# EAGLE design board (EAGLE 7.7.0)
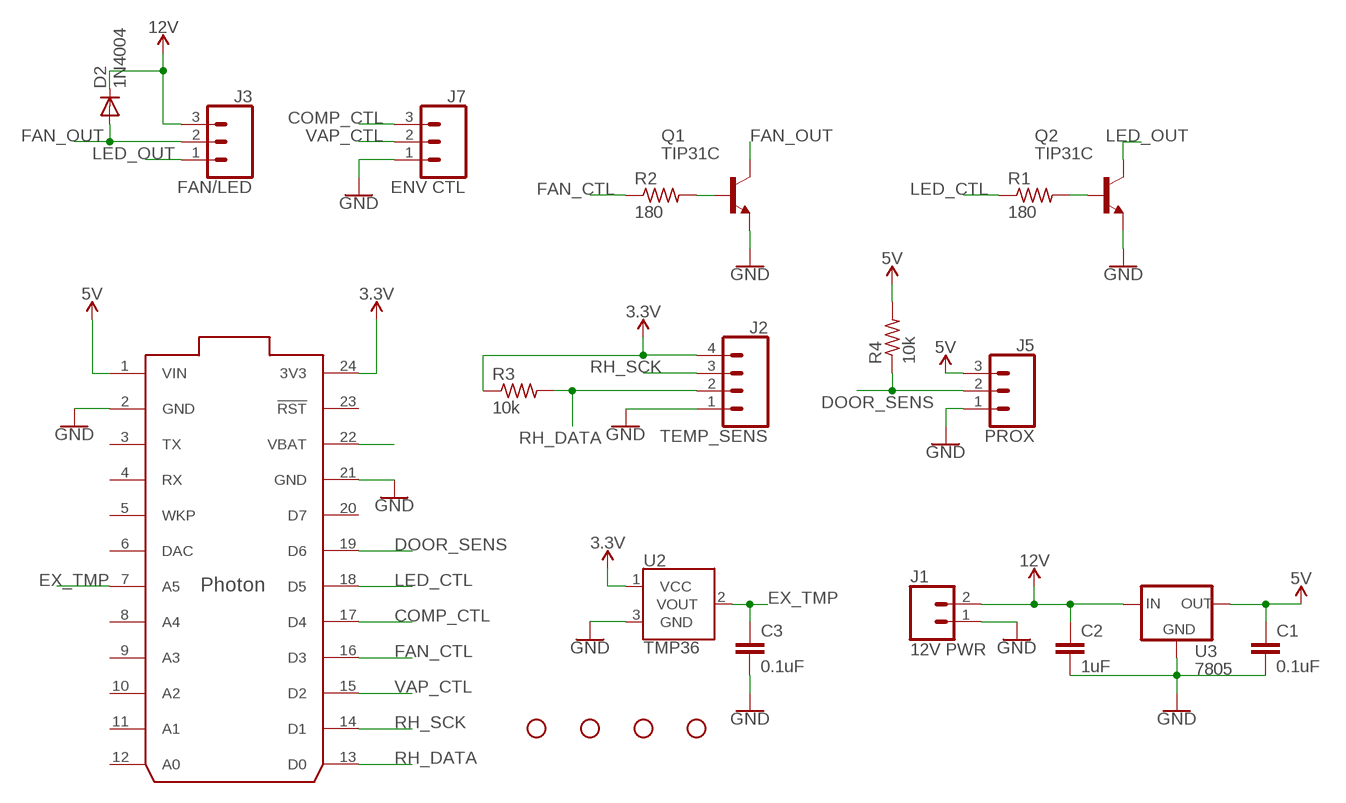
[diagram p0: schematic, sheet 1]

## Parts
C1  0.1uF  0.1UF-KIT-EZ-50V-20%  [CAP-PTH-SMALL-KIT]
C2  1uF  0.1UF-KIT-EZ-50V-20%  [CAP-PTH-SMALL-KIT]
C3  0.1uF  0.1UF-KIT-EZ-50V-20%  [CAP-PTH-SMALL-KIT]
D2  1N4004  [DO41-10]
H1  STAND-OFF  [STAND-OFF]
H2  STAND-OFF  [STAND-OFF]
H3  STAND-OFF  [STAND-OFF]
H4  STAND-OFF  [STAND-OFF]
J1  12V PWR  CONN_023.5MM  [SCREWTERMINAL-3.5MM-2]
J2  TEMP_SENS  CONN_04SCREW_LOCK  [SCREWTERMINAL-3.5MM-4_LOCK]
J3  FAN/LED  CONN_03-SCREW-5MM  [SCREWTERMINAL-5MM-3]
J5  PROX  CONN_03-SCREW-5MM  [SCREWTERMINAL-5MM-3]
J7  ENV CTL  CONN_03-SCREW-5MM  [SCREWTERMINAL-5MM-3]
Q1  TIP31C  [TO220]
Q2  TIP31C  [TO220]
R1  180  R-US_0207/10  [0207/10]
R2  180  R-US_0207/10  [0207/10]
R3  10k  R-US_0207/10  [0207/10]
R4  10k  R-US_0207/10  [0207/10]
U2  TMP36  TMP36GT9  [TO-92]
U3  7805  V_REG_78XX-TO-220  [TO-220-ALT]
U$1  PHOTON_SMD  [PHOTON_SMD]

## Nets
3.3V: J2.4 R3.1 U2.1(VCC) U$1.24(3V3)
5V [5VPWR]: C1.1 J5.3 R4.2 U3.OUT U$1.1(VIN)
12V [12VPWR]: C2.1 D2.C J1.2 J3.3 U3.IN
COMP_CTL: J7.3 U$1.17(D4)
DOOR_SENS: J5.2 R4.1 U$1.19(D6)
EX_TMP: C3.1 U2.2(VOUT) U$1.7(A5)
FAN_CTL: R2.1 U$1.16(D3)
FAN_OUT [12VPWR]: D2.A J3.2 Q1.2(C)
GND [Ground]: C1.2 C2.2 C3.2 J1.1 J2.1 J5.1 J7.1 Q1.3(E) Q2.3(E) U2.3(GND) U3.GND U$1.2(GND) U$1.21(GND)
LED_CTL: R1.1 U$1.18(D5)
LED_OUT [12VPWR]: J3.1 Q2.2(C)
N$1: U$1.22(VBAT)
N$3: Q2.1(B) R1.2
N$8: Q1.1(B) R2.2
RH_DATA: J2.2 R3.2 U$1.13(D0)
RH_SCK: J2.3 U$1.14(D1)
VAP_CTL: J7.2 U$1.15(D2)
Unconnected: U$1.3(TX) U$1.4(RX) U$1.5(WKP) U$1.6(DAC) U$1.8(A4) U$1.9(A3) U$1.10(A2) U$1.11(A1) U$1.12(A0) U$1.20(D7) U$1.23(!RST) U$1.25(EN) U$1.26(!SETUP) U$1.27(RGB_RED) U$1.28(RGB_GREEN) U$1.29(RGB_BLUE) U$1.30(USB_D-) U$1.31(USB_D+)

## Library data of the parts
C1 C3 = SparkFun-Capacitors:0.1UF: 0.1µF ceramic capacitors A capacitor is a passive two-terminal electrical component used to store electrical energy temporarily in an electric field.; PROD_ID: CAP-08370
C2 = SparkFun-Capacitors:0.1UF: 0.1µF ceramic capacitors A capacitor is a passive two-terminal electrical component used to store electrical energy temporarily in an electric field.; PROD_ID: CAP-08370; VALUE: 0.1uF
D2 = diode:1N4004: DIODE general purpose rectifier, 1 A
H1-H4 = SparkFun-Hardware:STAND-OFF: Stand Off Drill holes for mechanically mounting via screws, standoffs, etc. Note: Use the keepout ring to avoid running the screw head into surrounding components. Variant Overviews STAND-OFF - Mechanical footprint for a #4 phillips button head screw. STAND-OFF-TIGHT - Mechanical footprint for a #4 phillips button head screw, Example SparkFun Products Screw - Phillips Head (1/4", 4-40, 10 pack) <https://www.sparkfun.com/products/10453> (PRT-10453) Screw - Phillips Head (1/2", 4-40, 10 pack) <https://www.sparkfun.com/products/10452> (PRT-10452) Screw - Phillips Head (3/4", 4-40, 10 pack) <https://www.sparkfun.com/products/10451> (PRT-10451) Screw - Phillips Head (1", 4-40, 10 pack) <https://www.sparkfun.com/products/10450> (PRT-10450)
J1 = SparkFun-Connectors:CONN_02: Multi connection point. Often used as Generic Header-pin footprint for 0.1 inch spaced/style header connections On any of the 0.1 inch spaced packages, you can populate with these: Break Away Headers - Straight <https://www.sparkfun.com/products/116> (PRT-00116) Break Away Male Headers - Right Angle <https://www.sparkfun.com/products/553> (PRT-00553) Female Headers <https://www.sparkfun.com/products/115> (PRT-00115) Break Away Headers - Machine Pin <https://www.sparkfun.com/products/117> (PRT-00117) Break Away Female Headers - Swiss Machine Pin <https://www.sparkfun.com/products/743> (PRT-00743) For SCREWTERMINALS and SPRING TERMINALS visit here: Screw Terimnals on SparkFun.com <https://www.sparkfun.com/search/results?term=Screw+Terminals> (5mm/3.5mm/2.54mm spacing) This device is also useful as a general connection point to wire up your design to another part of your project. Our various solder wires solder well into these plated through hole pads. Hook-Up Wire - Assortment (Stranded, 22 AWG) <https://www.sparkfun.com/products/11375> (PRT-11375) Hook-Up Wire - Assortment (Solid Core, 22 AWG) <https://www.sparkfun.com/products/11367> (PRT-11367) View the entire wire category on our website here <https://www.sparkfun.com/categories/141> Special notes: Molex polarized connector foot print use with: PRT-08233 with associated crimp pins and housings. 2.54_SCREWTERM for use with PRT-10571. 3.5mm Screw Terminal footprints for PRT-08084 5mm Screw Terminal footprints for use with PRT-08432; PROD_ID: CONN-08399
J2 = SparkFun-Connectors:CONN_04: Multi connection point. Often used as Generic Header-pin footprint for 0.1 inch spaced/style header connections On any of the 0.1 inch spaced packages, you can populate with these: Break Away Headers - Straight <https://www.sparkfun.com/products/116> (PRT-00116) Break Away Male Headers - Right Angle <https://www.sparkfun.com/products/553> (PRT-00553) Female Headers <https://www.sparkfun.com/products/115> (PRT-00115) Break Away Headers - Machine Pin <https://www.sparkfun.com/products/117> (PRT-00117) Break Away Female Headers - Swiss Machine Pin <https://www.sparkfun.com/products/743> (PRT-00743) For SCREWTERMINALS and SPRING TERMINALS visit here: Screw Terimnals on SparkFun.com <https://www.sparkfun.com/search/results?term=Screw+Terminals> (5mm/3.5mm/2.54mm spacing) This device is also useful as a general connection point to wire up your design to another part of your project. Our various solder wires solder well into these plated through hole pads. Hook-Up Wire - Assortment (Stranded, 22 AWG) <https://www.sparkfun.com/products/11375> (PRT-11375) Hook-Up Wire - Assortment (Solid Core, 22 AWG) <https://www.sparkfun.com/products/11367> (PRT-11367) View the entire wire category on our website here <https://www.sparkfun.com/categories/141> Special notes: Molex polarized connector foot print use with SKU : PRT-08231 with associated crimp pins and housings. 1MM SMD Version SKU: PRT-10208
J3 J5 J7 = SparkFun-Connectors:CONN_03: Multi connection point. Often used as Generic Header-pin footprint for 0.1 inch spaced/style header connections On any of the 0.1 inch spaced packages, you can populate with these: Break Away Headers - Straight <https://www.sparkfun.com/products/116> (PRT-00116) Break Away Male Headers - Right Angle <https://www.sparkfun.com/products/553> (PRT-00553) Female Headers <https://www.sparkfun.com/products/115> (PRT-00115) Break Away Headers - Machine Pin <https://www.sparkfun.com/products/117> (PRT-00117) Break Away Female Headers - Swiss Machine Pin <https://www.sparkfun.com/products/743> (PRT-00743) Stackable Header - 3 Pin (Female, 0.1") <https://www.sparkfun.com/products/13875> (PRT-13875) For SCREWTERMINALS and SPRING TERMINALS visit here: Screw Terimnals on SparkFun.com <https://www.sparkfun.com/search/results?term=Screw+Terminals> (5mm/3.5mm/2.54mm spacing) This device is also useful as a general connection point to wire up your design to another part of your project. Our various solder wires solder well into these plated through hole pads. Hook-Up Wire - Assortment (Stranded, 22 AWG) <https://www.sparkfun.com/products/11375> (PRT-11375) Hook-Up Wire - Assortment (Solid Core, 22 AWG) <https://www.sparkfun.com/products/11367> (PRT-11367) View the entire wire category on our website here <https://www.sparkfun.com/categories/141> Special notes: Molex polarized connector foot print use with SKU : PRT-08232 with associated crimp pins and housings.; PROD_ID: CONN-10134; SF_SKU: PRT-08433
Q1 Q2 = transistor-npn:TIP31C*: NPN Transistor
R1-R4 = resistor:R-US_: RESISTOR, American symbol
U2 = SparkFun-Sensors:TMP36: TMP36 Precision Analog °C Temperature Sensor The TMP36 is a low voltage, precision centigrade temperature sensor. It provides a voltage output that is linearly proportional to the Celsius temperature. It also doesn’t require any external calibration to provide typical accuracies of ±1°C at +25°C and ±2°C over the −40°C to +125°C temperature range. We like it because it’s so easy to use: Just give the device a ground and 2.7 to 5.5 VDC and read the voltage on the Vout pin. The output voltage can be converted to temperature easily using the scale factor of 10 mV/°C. Datasheet <http://cdn.sparkfun.com/datasheets/Sensors/Temp/TMP35_36_37.pdf> SparkFun Products Temperature Sensor - TMP36 <https://www.sparkfun.com/products/10988> (SEN-10988) SparkFun Danger Shield <https://www.sparkfun.com/products/11649> (DEV-11649); PROD_ID: IC-09880; SF_ID: SEN-10988
U3 = SparkFun-IC-Power:V_REG_78XX: Voltage Regulator Standard 78xx regulator. IGO (Input Ground Output). Spark Fun Electronics SKU : COM-00107; PROD_ID: VREG-08450; SF_ID: COM-00107
U$1 = Particle-Devices:PHOTON_SMD: Particle Photon (without headers) WiFi development board footprint - designed to be surface mounted with 7 extra exposed pads on the bottom of the board which include, 3 RGB LED outputs, /SETUP, EN (3.3V SMPS enable input), USB D+ and USB D-. Product datasheet: here <https://docs.particle.io/datasheets/photon-(wifi)/photon-datasheet/> Design files: here <https://github.com/particle-iot/photon> Github : Particle devices library <https://github.com/particle-iot/hardware-libraries/tree/master/Eagle>

## Net classes
0 default: width 0.457 mm
1 12VPWR: width 0.813 mm
2 5VPWR: width 0.61 mm
3 Ground: width 0.813 mm

## Board
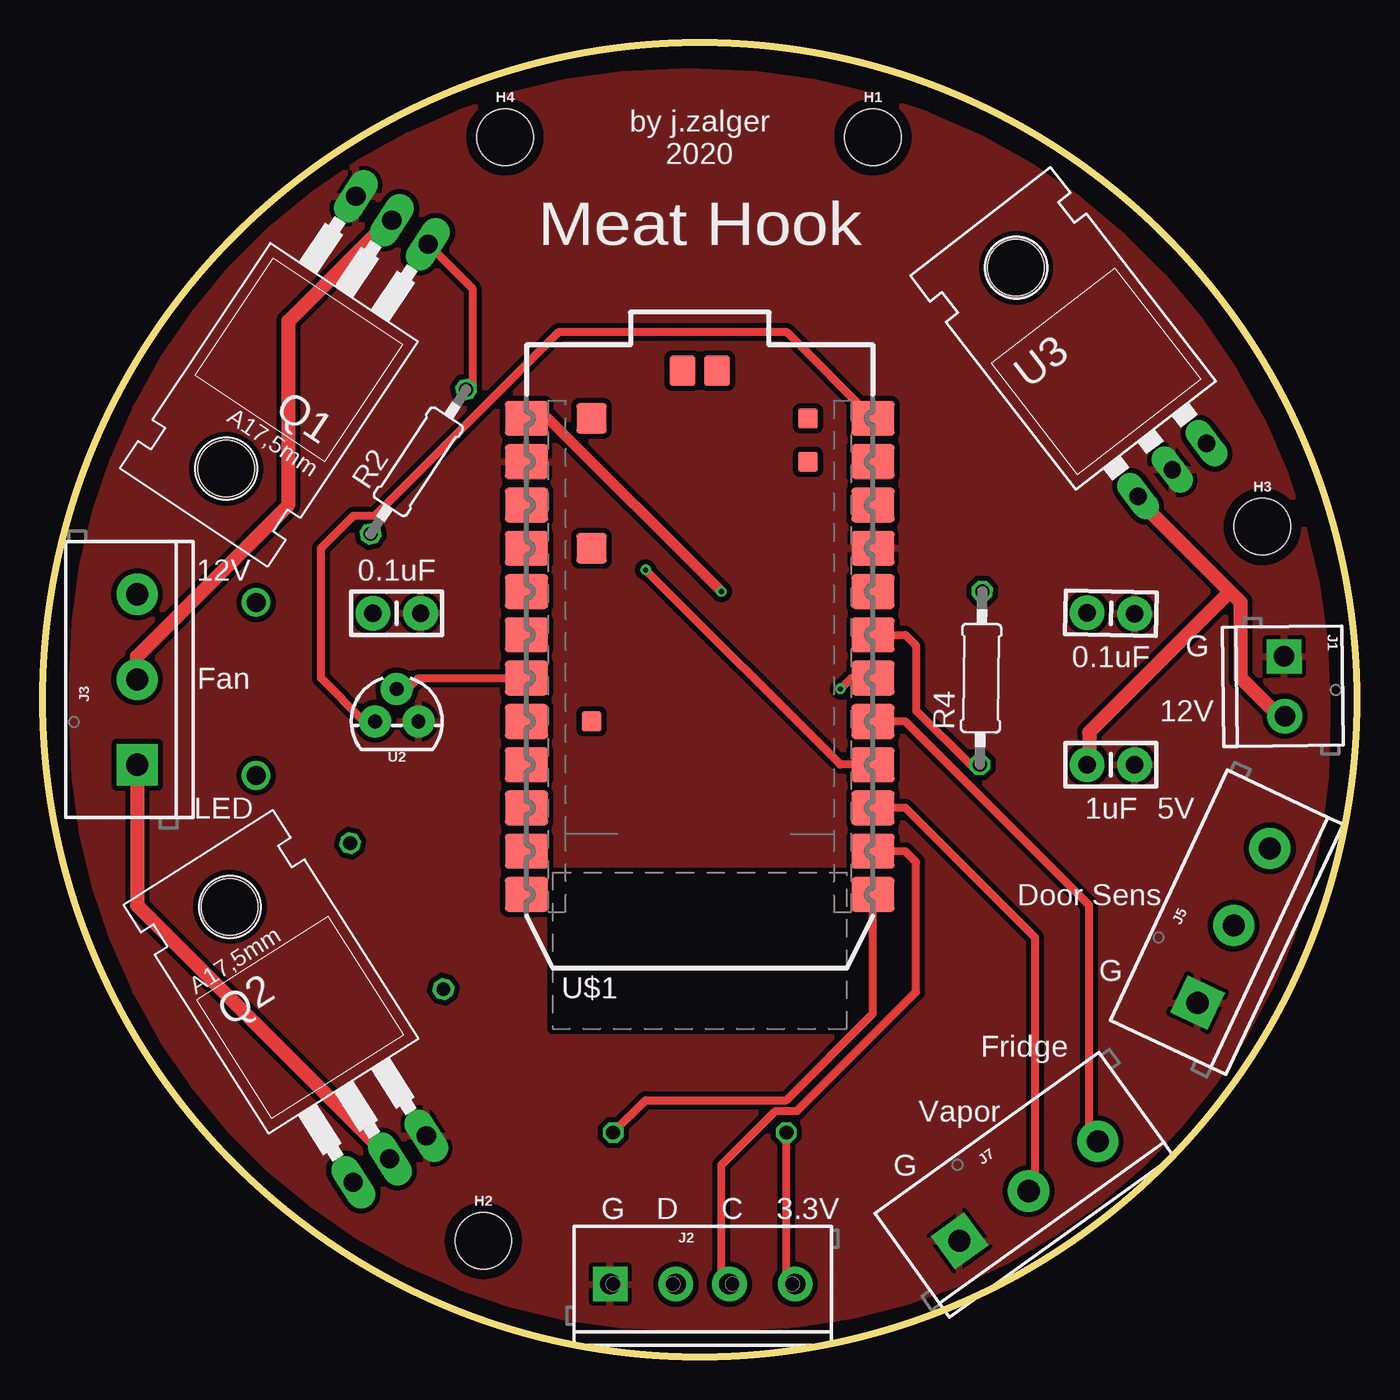
[diagram p1: board, top side]
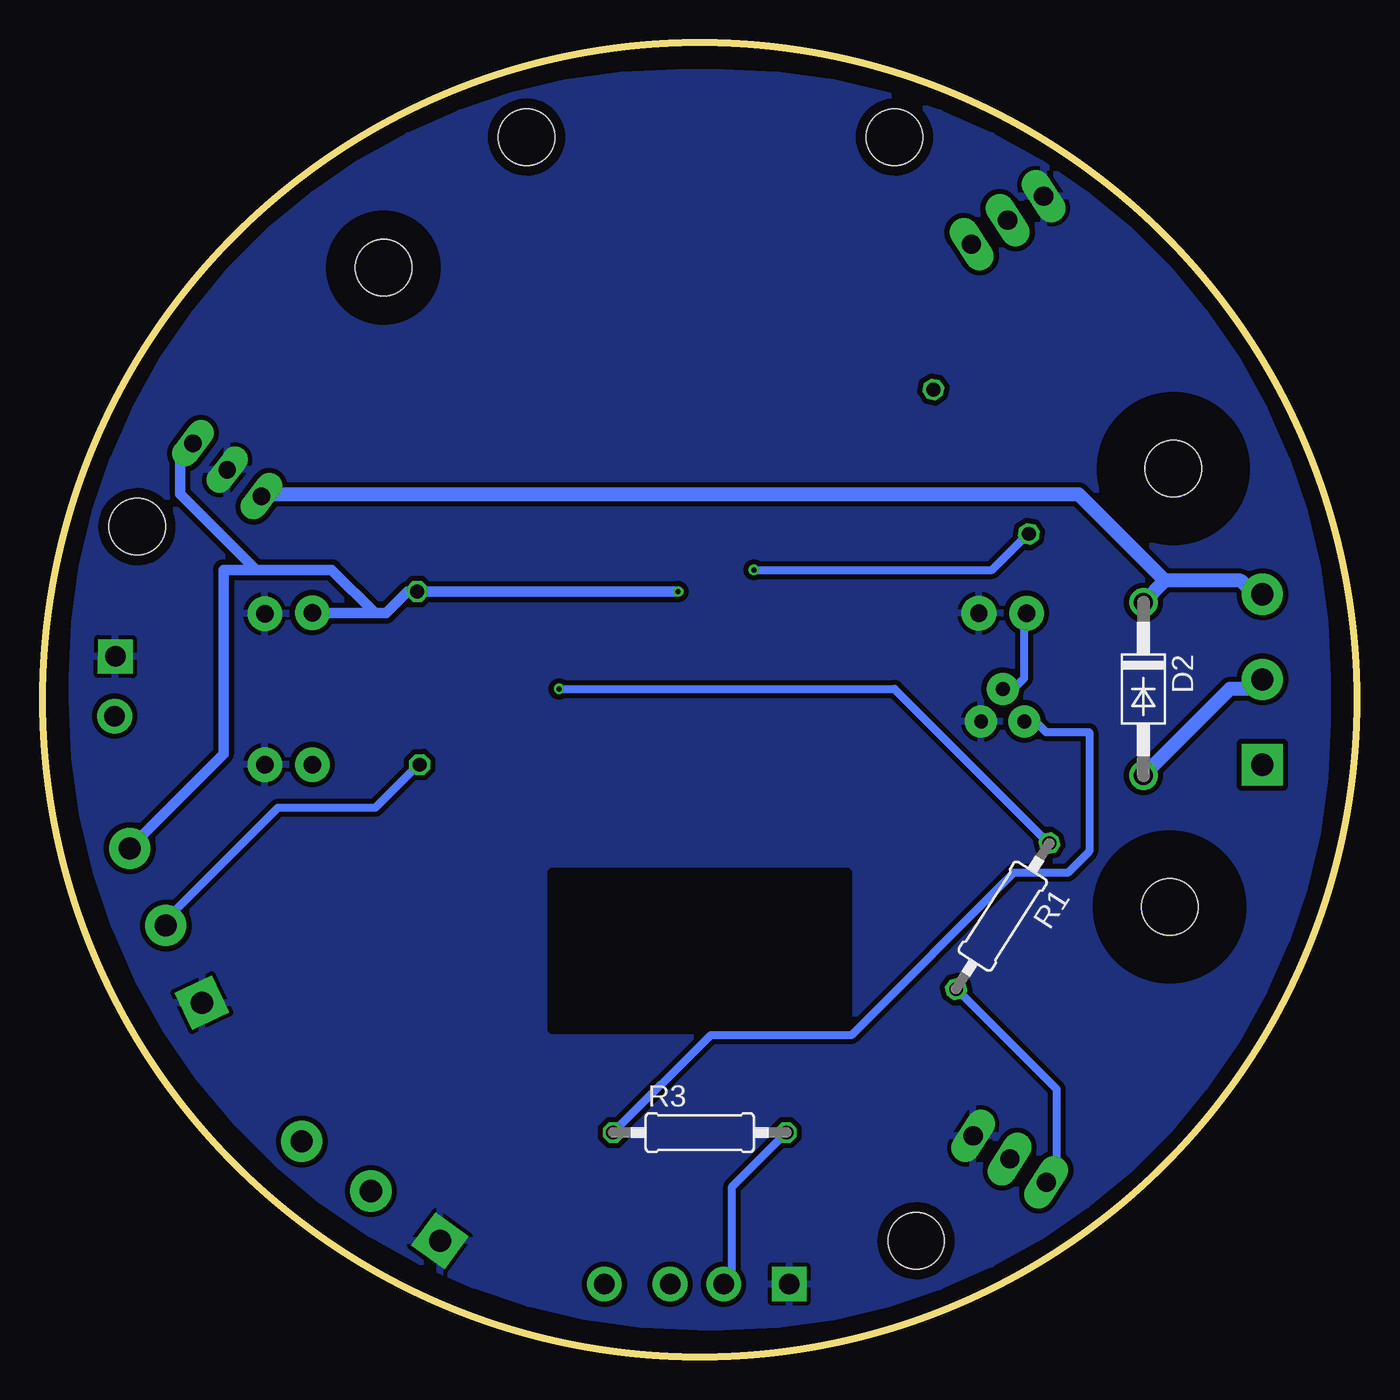
[diagram p2: board, bottom side, seen from below]

Size 77.13 x 77.13 mm. Coordinates in mm from the lower left corner, seen from the top.
Outline: circle at 38.56,38.56 radius 38.56
Copper layers (1*16): Top 0.035mm / dielectric 1.6mm / Bottom 0.035mm
Design rules "Elecrow_2-layer_PCB_eagle_rule": minimum track width 6mil, minimum drill 12mil, track to track 6mil, track to pad 6mil, pad to pad 6mil, via to via 8mil, smd to smd 0mil, copper to edge 20mil, drill to drill 10mil, minimum pad ring 6mil, minimum via ring 6mil, stop-mask expansion 0mil, vias tented up to drill 100mil, thermal gap 10mil

### Footprints (pad centres in the part's own frame; a part is rotated, then mirrored left to right if it is on the bottom)
CAP-PTH-SMALL-KIT = drill 1.016 pad 2.032: 1 -1.397,0; 2 1.397,0
DO41-10 = drill 1.118: A 5.08,0; C -5.08,0
STAND-OFF = hole 3.302: 0,0
SCREWTERMINAL-3.5MM-2 = drill 1.2 pad 2.032 square: 1 0,0 | drill 1.2 pad 2.032: 2 3.5,0
SCREWTERMINAL-3.5MM-4_LOCK = drill 1.2 pad 2.032 square: 1 -0.178,0 | drill 1.2 pad 2.032: 2 3.678,0; 3 6.822,0; 4 10.678,0
SCREWTERMINAL-5MM-3 = drill 1.3 pad 2.413 square: 1 0,0 | drill 1.3 pad 2.413: 2 5,0; 3 10,0
TO220 = drill 1.118 long: 1 -2.54,-6.35; 2 0,-6.35; 3 2.54,-6.35 | hole 3.302: 0,11.176
0207/10 = drill 0.813 octagon: 1 -5.08,0; 2 5.08,0
TO-92 = drill 0.813 pad 1.88: 1 -1.27,0; 2 0,1.905; 3 1.27,0
TO-220-ALT = drill 1.016 long: GND 0,-3.81; IN -2.54,-3.81; OUT 2.54,-3.81 | hole 3.302: 0,11.176
PHOTON_SMD = smd 2.54 x 2.032: 1 0,33.02; 2 0,30.48; 3 0,27.94; 4 0,25.4; 5 0,22.86; 6 0,20.32; 7 0,17.78; 8 0,15.24; 9 0,12.7; 10 0,10.16; 11 0,7.62; 12 0,5.08; 13 20.32,5.08; 14 20.32,7.62; 15 20.32,10.16; 16 20.32,12.7; 17 20.32,15.24; 18 20.32,17.78; 19 20.32,20.32; 20 20.32,22.86; 21 20.32,25.4; 22 20.32,27.94; 23 20.32,30.48; 24 20.32,33.02 | smd 1.778 x 1.778: 25 3.81,33.02; 26 3.81,25.4 | smd 1.143 x 1.143: 27 3.81,15.24; 28 16.51,30.48; 29 16.51,33.02 | smd 1.524 x 1.778: 30 11.176,35.814; 31 9.144,35.814

### Placement (x,y rotation side)
C1  62.69,43.64 358.7 top
C2  62.69,34.75 0 top
C3  20.78,43.64 0 top
D2  12.53,39.2 270 bottom
H1  48.72,71.58 0 top
H2  25.86,6.81 0 top
H3  71.58,48.72 0 top
H4  27.13,71.58 0 top
J1  72.85,41.1 270.7 top
J2  33.48,4.27 0 top
J3  5.54,34.75 90 top
J5  67.77,20.78 64.9 top
J7  53.8,6.81 35.7 top
Q1  16.97,61.42 146.3 top
Q2  16.97,16.97 32.4 top
R1  20.78,25.86 237.4 bottom
R2  22.05,52.53 56.5 top
R3  38.56,13.16 0 bottom
R4  55.07,39.83 89.2 top
U2  20.78,37.29 0 top
U3  63.96,55.07 37.7 top
U$1  28.4,22.05 0 top

### Tracks (layer width: path | path; a pad name or v marks a point on that pad's centre or on a via)
3.3V
  Top 0.457: R3.1 43.64,4.27 J2.4 | U$1.24 43.64,60.15 30.31,60.15 19.51,49.36 18.24,49.36 16.34,47.45 16.34,39.83 18.88,37.29 U2.1
  Bottom 0.457: R3.1 37.93,18.88 29.67,18.88 20.15,28.4 16.97,28.4 15.7,29.67 15.7,36.66 18.24,36.66 18.88,37.29 U2.1
5V  (via drill 0.3)
  Top 0.61: U$1.1 29.67,55.07 v39.83,44.91
  Bottom 0.61: 57.61,43.64 60.79,43.64 C1.1 | 57.61,43.64 56.98,43.64 55.71,44.91 R4.2 55.07,44.91 v39.83,44.91 | 64.6,46.18 69.04,50.63 69.04,52.53 68.41,53.17 U3.OUT | 64.6,46.18 60.15,46.18 57.61,43.64 | 64.6,46.18 66.5,46.18 66.5,35.39 71.58,30.31 J5.3
12V
  Top 0.813: 69.68,44.91 70.31,44.28 70.31,39.83 72.85,37.29 J1.2 | 69.68,44.91 64.6,49.99 U3.IN | 69.68,44.91 61.42,36.66 61.42,34.75 C2.1
  Bottom 0.813: 11.26,45.55 D2.C | 11.26,45.55 6.81,45.55 6.18,44.91 5.54,44.91 J3.3 | 11.26,45.55 16.34,50.63 63.96,50.63 U3.IN
COMP_CTL
  Top 0.457: U$1.17 50.63,37.29 61.42,26.5 61.42,13.16 J7.3
DOOR_SENS
  Top 0.457: U$1.19 50.63,42.37 51.26,41.74 51.26,37.93 54.44,34.75 R4.1
  Bottom 0.457: J5.2 69.68,25.86 63.33,32.21 57.61,32.21 55.07,34.75 R4.1
EX_TMP
  Top 0.457: U$1.7 22.05,39.83 21.42,39.2 U2.2
  Bottom 0.457: U2.2 20.15,39.2 19.51,39.83 19.51,43.64 C3.1
FAN_CTL  (via drill 0.3)
  Top 0.457: v35.39,46.18 46.82,34.75 U$1.16
  Bottom 0.457: v35.39,46.18 21.42,46.18 19.51,48.09 R2.1
FAN_OUT
  Top 0.813: J3.2 5.54,41.1 14.43,49.99 14.43,60.79 20.15,66.5 Q1.2
  Bottom 0.813: D2.A 7.45,39.2 5.54,39.2 J3.2
GND
  pour Bottom (isolate 0.305): 38.56,1.73 arc90 75.39,38.56 75.39,39.83 arc90 39.83,75.39 37.29,75.39 arc90 1.73,39.83 1.73,37.29 arc90 37.29,1.73
  pour Top (isolate 0.305): 41.1,1.73 arc90 75.39,37.29 75.39,38.56 arc90 38.56,75.39 37.29,75.39 arc90 1.73,39.83 1.73,37.29 arc90 37.29,1.73
LED_CTL  (via drill 0.3)
  Top 0.457: v46.82,39.2 47.45,39.83 U$1.18
  Bottom 0.457: v46.82,39.2 27.13,39.2 18.24,30.31 R1.1
LED_OUT
  Top 0.813: J3.1 5.54,26.5 20.15,11.89 Q2.2
N$3
  Bottom 0.457: R1.2 23.32,21.42 17.61,15.7 17.61,10.62 Q2.1
N$8
  Top 0.457: R2.2 25.23,56.98 25.23,62.69 22.69,65.23 Q1.1
RH_DATA
  Top 0.457: U$1.13 48.72,20.15 43.64,15.07 35.39,15.07 R3.2
  Bottom 0.457: R3.2 36.66,9.99 36.66,4.27 J2.2
RH_SCK
  Top 0.457: U$1.14 50.63,29.67 51.26,29.04 51.26,21.42 44.28,14.43 43.01,14.43 39.83,11.26 39.83,4.27 J2.3
VAP_CTL
  Top 0.457: U$1.15 50.63,32.21 58.25,24.59 58.25,9.99 J7.2

### Text on the board
tPlace: by j.zalger / 2020 | Meat Hook | 12V | 0.1uF | G | 0.1uF | Fan | 12V | LED | 1uF | 5V | Door Sens | G | Fridge | Vapor | G | G | D | C | 3.3V